# Altium schematic sheet 10_microphone.SchDoc
size A4; SheetNumber: 11; SheetTotal: 13
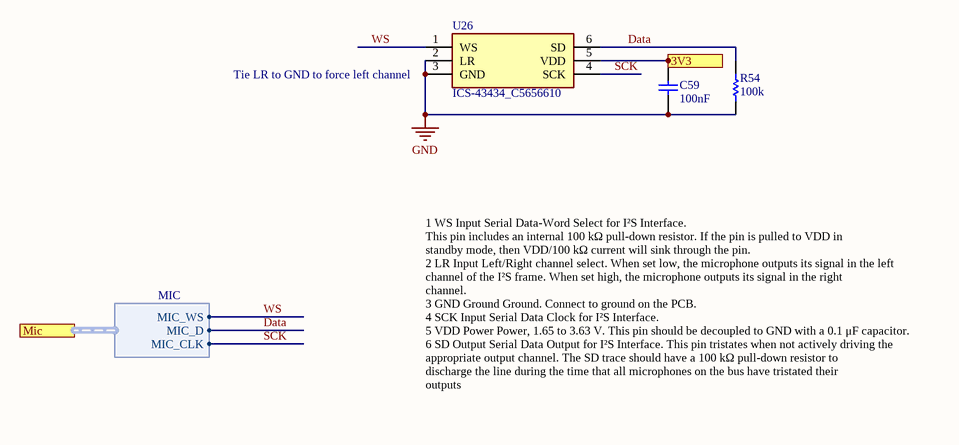
[diagram p0: 10_microphone.SchDoc]

## Parts
C59  value 100nF  [CAP0603R]  (hidden comment: EMF107B7104KAHT)
R54  100k  [RESC1609X55X30NL10T20]
U26  ICS-43434_C5656610  [MIC-SMD_6P-L3.5-W2.7-P0.90-BL]

## Ports
3V3, Mic (harness MIC)

## Harnesses
MIC: MIC_WS, MIC_D, MIC_CLK

## Nets
GND: C59.1 R54.2 U26.2(LR) U26.3(GND)
3V3: C59.2 U26.5(VDD) ; port 3V3
Data: R54.1 U26.6(SD) ; port Mic.MIC_D
SCK: U26.4(SCK) ; port Mic.MIC_CLK
WS: U26.1(WS) ; port Mic.MIC_WS

## Notes on the sheet
- (near U26) Tie LR to GND to force left channel
- 1 WS Input Serial Data-Word Select for I²S Interface.
  This pin includes an internal 100 kΩ pull-down resistor. If the pin is pulled to VDD in
  standby mode, then VDD/100 kΩ current will sink through the pin.
  2 LR Input Left/Right channel select. When set low, the microphone outputs its signal in the left
  channel of the I²S frame. When set high, the microphone outputs its signal in the right
  channel.
  3 GND Ground Ground. Connect to ground on the PCB.
  4 SCK Input Serial Data Clock for I²S Interface.
  5 VDD Power Power, 1.65 to 3.63 V. This pin should be decoupled to GND with a 0.1 μF capacitor.
  6 SD Output Serial Data Output for I²S Interface. This pin tristates when not actively driving the
  appropriate output channel. The SD trace should have a 100 kΩ pull-down resistor to
  discharge the line during the time that all microphones on the bus have tristated their
  outputs
- Date:
- A4
- Project:
- Time:
- Sheet
- of
- Revision:
- File:
- Drawn By:

## Library data of the parts
C59 = CMP-024-000573-8: CAP, MLCC, 0603/1608, 16V, X7R,; Manufacturer: Taiyo Yuden; Tolerance: 10%; Case/Package: 0603 (1608 Metric); Supplier 1: Digi-Key; Max Operating Temperature: 125°C; PN: EMF107B7104KAHT; Temperature Coefficient: X7R; ComponentLink1URL: https://ds.yuden.co.jp/TYCOMPAS/ut/detail?pn=EMF107B7104KAHT&u=M; Min Operating Temperature: -55°C; ComponentLink1Description: Datasheet; Supplier Part Number 1: 587-6558-1-ND; Rating: AEC-Q200
R54 = CMP-2000-03692-1: Manufacturer: Vishay Dale; Part Number: TNPW060310K0BEEN
U26 = ICS-43434_C5656610: Direction:Omnidirectional Voltage - Supply:1.65V~3.63V Voltage - Supply:1.65V~3.63V Current Consumption:550uA Current Consumption:550uA S/N Ratio:64dB Sensitivity:-26dB Sensitivity:-26dB Output Type:I2S Length:3.5mm Width:2.65mm Height:0.98mm Operating Te; Manufacturer: TDK InvenSense(应美盛); Current Consumption: 550uA; S/N Ratio: 64dB; Sensitivity: -26dB; Output Type: I2S; LCSC Part Name: 1.65V~3.63V; Supplier Part: C5656610; Manufacturer Part: ICS-43434; Supplier Footprint: LGA-6(3.5x2.7); JLCPCB Part Class: Extended Part; Datasheet: https://item.szlcsc.com/datasheet/ICS-43434/6577565.html; Supplier: LCSC; Direction: Omnidirectional; Voltage - Supply: 1.65V~3.63V; Length: 3.5mm; Width: 2.65mm; Height: 0.98mm; Operating Temperature: -40℃~+85℃; Features: Omnidirectional pickup